# Altium schematic sheet [03]Pressure and Flow.SchDoc
size A3
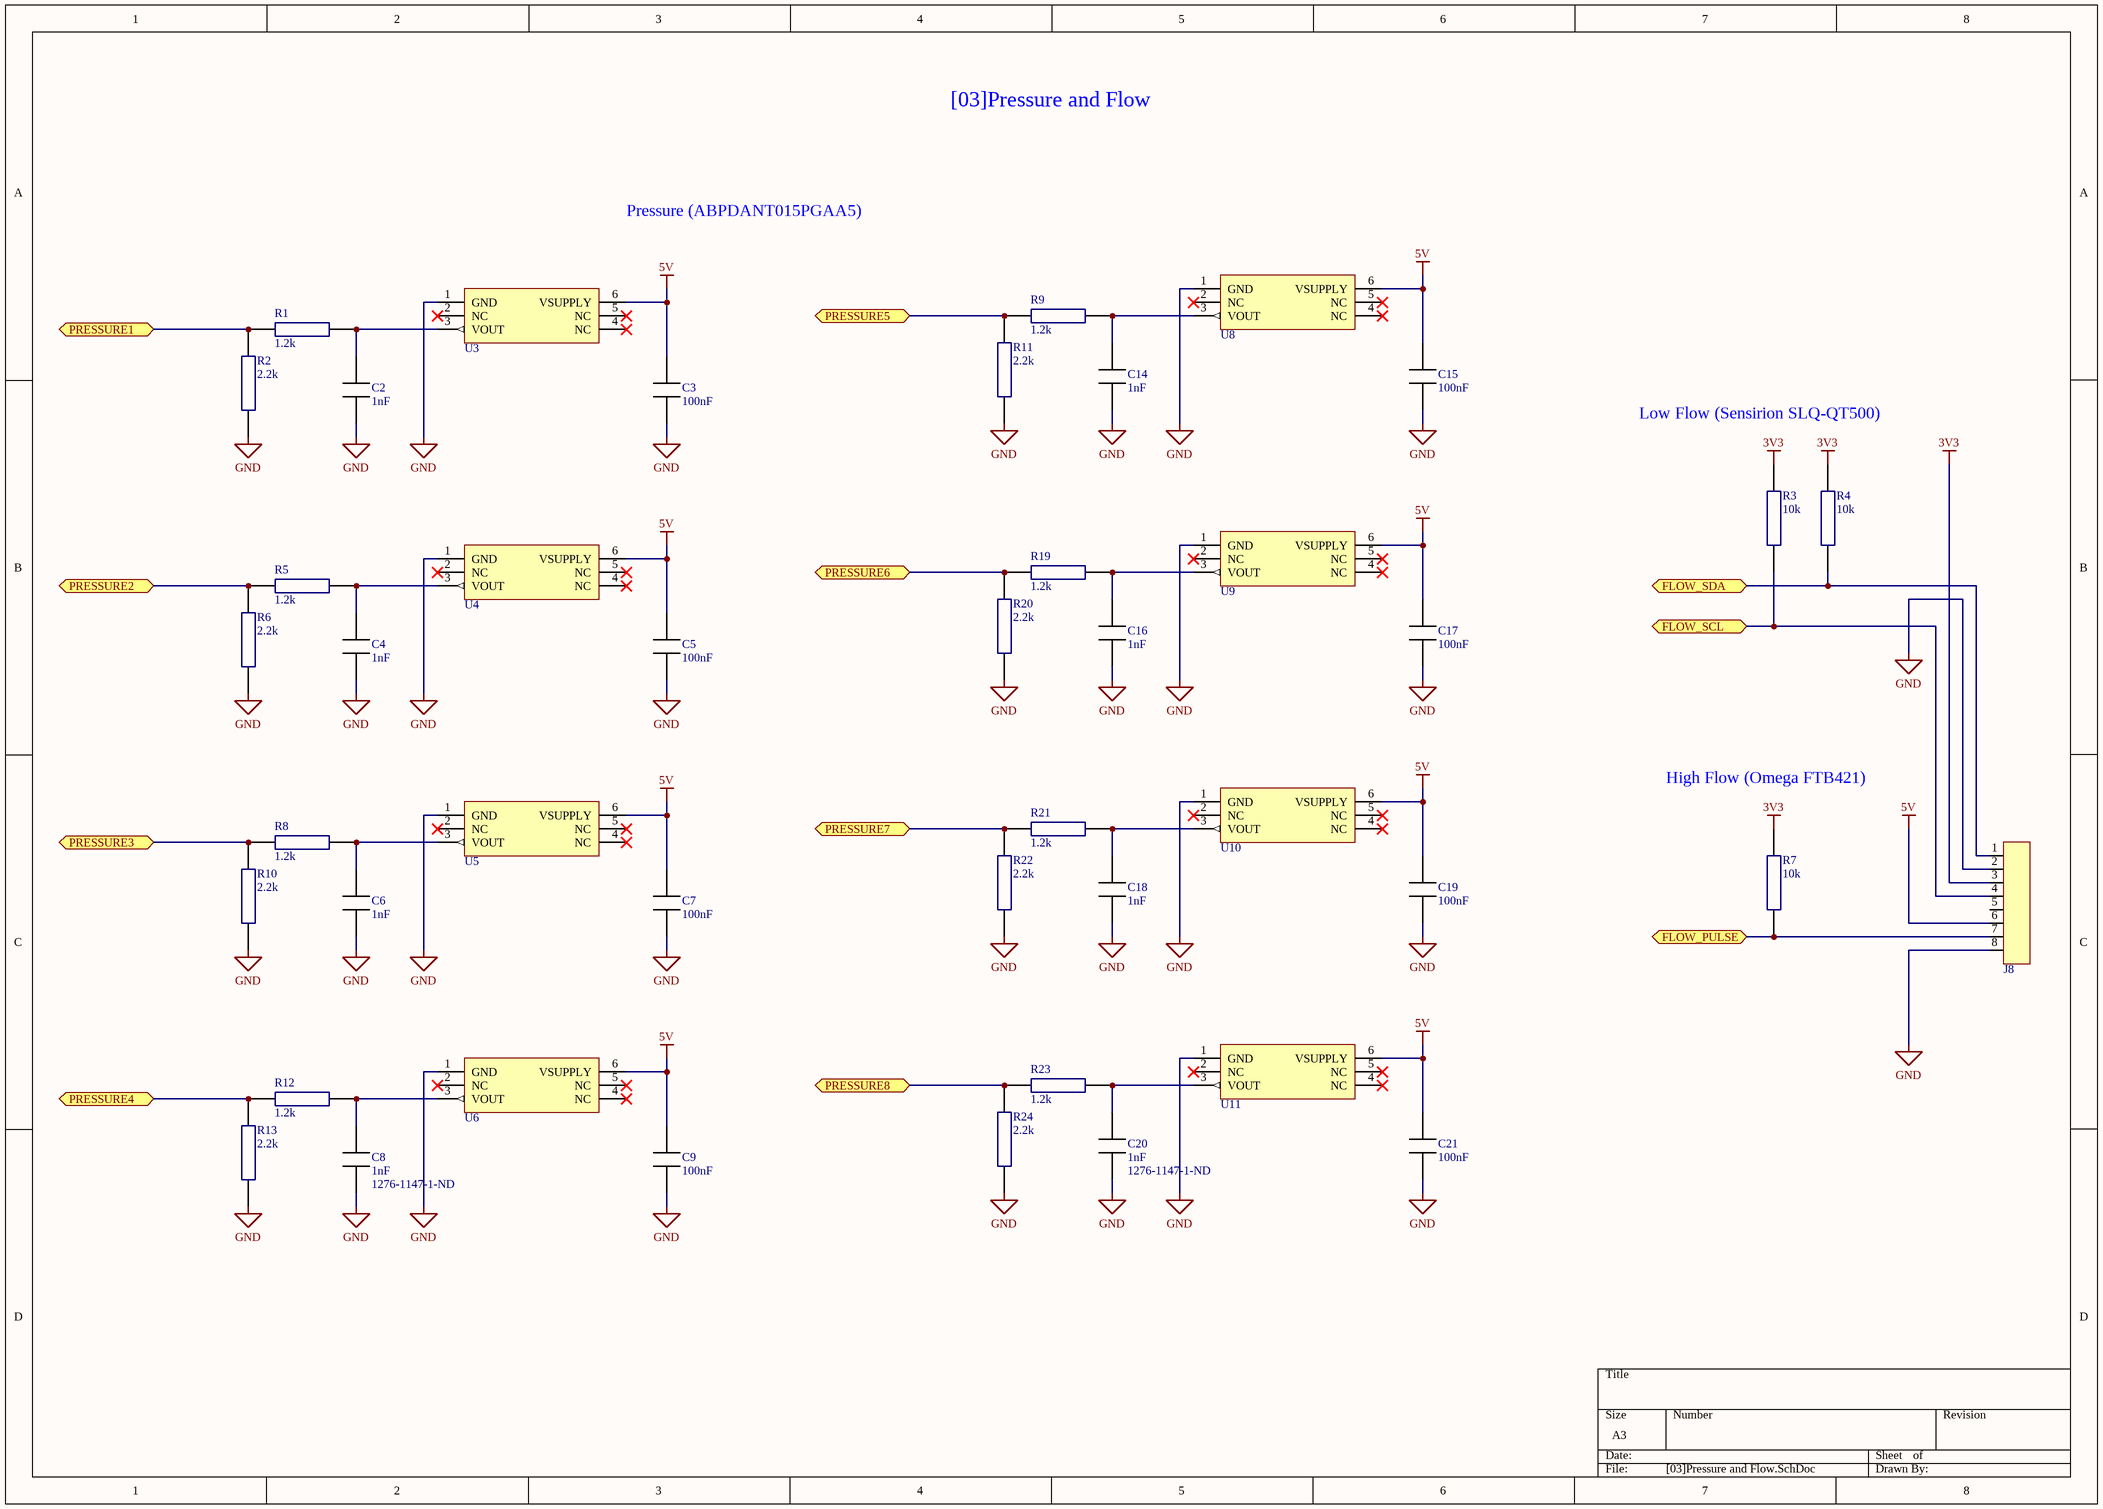
[diagram p0: [03]Pressure and Flow.SchDoc]

## Parts
C2  1nF  [CAPC2012X09N]
C3  100nF  [CAPC2012X09N]
C4  1nF  [CAPC2012X09N]
C5  100nF  [CAPC2012X09N]
C6  1nF  [CAPC2012X09N]
C7  100nF  [CAPC2012X09N]
C8  1nF  Supplier Part Number 1: 1276-1147-1-ND  [CAPC2012X09N]
C9  100nF  [CAPC2012X09N]
C14  1nF  [CAPC2012X09N]
C15  100nF  [CAPC2012X09N]
C16  1nF  [CAPC2012X09N]
C17  100nF  [CAPC2012X09N]
C18  1nF  [CAPC2012X09N]
C19  100nF  [CAPC2012X09N]
C20  1nF  Supplier Part Number 1: 1276-1147-1-ND  [CAPC2012X09N]
C21  100nF  [CAPC2012X09N]
J8  1771156  [1771156]  (value not drawn)
R1  1.2k  [RESC2012X07N_SAMSUNG]
R2  2.2k  [RESC2012X07N_SAMSUNG]
R3  10k  [RESC2012X07N_SAMSUNG]
R4  10k  [RESC2012X07N_SAMSUNG]
R5  1.2k  [RESC2012X07N_SAMSUNG]
R6  2.2k  [RESC2012X07N_SAMSUNG]
R7  10k  [RESC2012X07N_SAMSUNG]
R8  1.2k  [RESC2012X07N_SAMSUNG]
R9  1.2k  [RESC2012X07N_SAMSUNG]
R10  2.2k  [RESC2012X07N_SAMSUNG]
R11  2.2k  [RESC2012X07N_SAMSUNG]
R12  1.2k  [RESC2012X07N_SAMSUNG]
R13  2.2k  [RESC2012X07N_SAMSUNG]
R19  1.2k  [RESC2012X07N_SAMSUNG]
R20  2.2k  [RESC2012X07N_SAMSUNG]
R21  1.2k  [RESC2012X07N_SAMSUNG]
R22  2.2k  [RESC2012X07N_SAMSUNG]
R23  1.2k  [RESC2012X07N_SAMSUNG]
R24  2.2k  [RESC2012X07N_SAMSUNG]
U3  ABPDANT015PGAA5_SMD  [DIP6 SMD]  (value not drawn)
U4  ABPDANT015PGAA5_SMD  [DIP6 SMD]  (value not drawn)
U5  ABPDANT015PGAA5_SMD  [DIP6 SMD]  (value not drawn)
U6  ABPDANT015PGAA5_SMD  [DIP6 SMD]  (value not drawn)
U8  ABPDANT015PGAA5_SMD  [DIP6 SMD]  (value not drawn)
U9  ABPDANT015PGAA5_SMD  [DIP6 SMD]  (value not drawn)
U10  ABPDANT015PGAA5_SMD  [DIP6 SMD]  (value not drawn)
U11  ABPDANT015PGAA5_SMD  [DIP6 SMD]  (value not drawn)

## Ports
FLOW_PULSE (bidir), FLOW_SCL (bidir), FLOW_SDA (bidir), PRESSURE1 (bidir), PRESSURE2 (bidir), PRESSURE3 (bidir), PRESSURE4 (bidir), PRESSURE5 (bidir), PRESSURE6 (bidir), PRESSURE7 (bidir), PRESSURE8 (bidir)

## Nets
3V3: J8.3 R3.2 R4.2 R7.2
5V: C3.2 C5.2 C7.2 C9.2 C15.2 C17.2 C19.2 C21.2 J8.6 U3.6(VSUPPLY) U4.6(VSUPPLY) U5.6(VSUPPLY) U6.6(VSUPPLY) U8.6(VSUPPLY) U9.6(VSUPPLY) U10.6(VSUPPLY) U11.6(VSUPPLY)
GND: C2.1 C3.1 C4.1 C5.1 C6.1 C7.1 C8.1 C9.1 C14.1 C15.1 C16.1 C17.1 C18.1 C19.1 C20.1 C21.1 J8.2 J8.8 R2.1 R6.1 R10.1 R11.1 R13.1 R20.1 R22.1 R24.1 U3.1(GND) U4.1(GND) U5.1(GND) U6.1(GND) U8.1(GND) U9.1(GND) U10.1(GND) U11.1(GND)
FLOW_PULSE: J8.7 R7.1 ; port FLOW_PULSE
FLOW_SCL: J8.4 R3.1 ; port FLOW_SCL
FLOW_SDA: J8.1 R4.1 ; port FLOW_SDA
PRESSURE1: R1.1 R2.2 ; port PRESSURE1
PRESSURE2: R5.1 R6.2 ; port PRESSURE2
PRESSURE3: R8.1 R10.2 ; port PRESSURE3
PRESSURE4: R12.1 R13.2 ; port PRESSURE4
PRESSURE5: R9.1 R11.2 ; port PRESSURE5
PRESSURE6: R19.1 R20.2 ; port PRESSURE6
PRESSURE7: R21.1 R22.2 ; port PRESSURE7
PRESSURE8: R23.1 R24.2 ; port PRESSURE8
NetC2_2: C2.2 R1.2 U3.3(VOUT)
NetC4_2: C4.2 R5.2 U4.3(VOUT)
NetC6_2: C6.2 R8.2 U5.3(VOUT)
NetC8_2: C8.2 R12.2 U6.3(VOUT)
NetC14_2: C14.2 R9.2 U8.3(VOUT)
NetC16_2: C16.2 R19.2 U9.3(VOUT)
NetC18_2: C18.2 R21.2 U10.3(VOUT)
NetC20_2: C20.2 R23.2 U11.3(VOUT)

Not connected (* = marked no-connect by the designer): J8 5; U3 2(NC)* 4(NC)* 5(NC)*; U4 2(NC)* 4(NC)* 5(NC)*; U5 2(NC)* 4(NC)* 5(NC)*; U6 2(NC)* 4(NC)* 5(NC)*; U8 2(NC)* 4(NC)* 5(NC)*; U9 2(NC)* 4(NC)* 5(NC)*; U10 2(NC)* 4(NC)* 5(NC)*; U11 2(NC)* 4(NC)* 5(NC)*

## Notes on the sheet
- [03]Pressure and Flow
- Pressure (ABPDANT015PGAA5)
- Low Flow (Sensirion SLQ-QT500)
- High Flow (Omega FTB421)

## Library data of the parts
C2 C4 C6 C8 C14 C16 C18 C20 = CL21C102JBCNNNC: CAP CER 1nF 50V C0G/NP0 0805; Manufacturer: Samsung Electro-Mechanics America, Inc.; Manufacturer Part Number: CL21F104ZBCNNNC; Capacitance: 0.10µF; Tolerance: -20%, +80%; Temperature Coefficient: Y5V (F); RoHS: RoHS Compliant; Category: Capacitors; Packaging: Cut Tape (CT); Voltage - Rated: 50V; Mounting Type: Surface Mount, MLCC; Operating Temperature: -30°C ~ 85°C; Applications: General Purpose; Ratings: -; Package / Case: 0805 (2012 Metric); Size / Dimension: 0.079" L x 0.049" W (2.00mm x 1.25mm); Height - Seated (Max): -; Thickness (Max): 0.037" (0.95mm); Lead Spacing: -; Features: -; Lead Style: -; ComponentLink1URL: http://www.samsungsem.com/kr/support/product-search/mlcc/CL21F104ZBCNNNC.jsp; ComponentLink1Description: http://www.samsungsem.com/kr/support/product-search/mlcc/CL21F104ZBCNNNC.jsp; Supplier 1: Digi-Key
  C2 C4 C6 C14 C16 C18: Supplier Part Number 1: 1276-1147-1-ND
C3 C5 C7 C9 C15 C17 C19 C21 = CL21F104ZBCNNNC: CAP CER 0.1UF 50V Y5V 0805; Manufacturer: Samsung Electro-Mechanics America, Inc.; Capacitance: 0.10µF; Tolerance: -20%, +80%; Temperature Coefficient: Y5V (F); Supplier 1: Digi-Key; Manufacturer Part Number: CL21F104ZBCNNNC; RoHS: RoHS Compliant; Category: Capacitors; Stock 1: 1030146; Pricing 1: 1=0.1, 10=0.031, 25=0.022, 50=0.017, 100=0.0144, 500=0.01004, 1000=0.00783 (USD); Packaging: Cut Tape (CT); Voltage - Rated: 50V; Mounting Type: Surface Mount, MLCC; Operating Temperature: -30°C ~ 85°C; Applications: General Purpose; Ratings: -; Package / Case: 0805 (2012 Metric); Size / Dimension: 0.079" L x 0.049" W (2.00mm x 1.25mm); Height - Seated (Max): -; Thickness (Max): 0.037" (0.95mm); Lead Spacing: -; Features: -; Lead Style: -; ComponentLink1URL: http://www.samsungsem.com/kr/support/product-search/mlcc/CL21F104ZBCNNNC.jsp; ComponentLink1Description: http://www.samsungsem.com/kr/support/product-search/mlcc/CL21F104ZBCNNNC.jsp; Supplier Part Number 1: 1276-1007-1-ND
J8 = 1771156: CONN TERM BLK 8POS 2.5MM SMD; Manufacturer: Phoenix Contact; Positions Per Level: 8; Pitch: 0.098" (2.50mm); Mating Orientation: Vertical with Board; Wire Gauge: 20-26 AWG; Wire Termination: Screwless - Spring Cage, Tension Clamp; Supplier 1: Digi-Key; Manufacturer Part Number: 1771156; RoHS: RoHS Compliant; Category: Connectors, Interconnects; Stock 1: 2856; Pricing 1: 1=1.39, 10=1.334, 50=1.276, 100=1.2412 (USD); Packaging: Cut Tape (CT); Part Status: Active; Mounting Type: Surface Mount; Features: Solder Retention; Color: Black; Operating Temperature: -; Housing Material: Liquid Crystal Polymer (LCP); Contact Material - Plating: -; Clamp Material - Plating: -; Screw Material - Plating: -; Torque - Screw: -; Screw Thread: -; ComponentLink1URL: https://media.digikey.com/pdf/Data%20Sheets/Phoenix%20Contact%20PDFs/1771156.pdf; ComponentLink1Description: https://media.digikey.com/pdf/Data%20Sheets/Phoenix%20Contact%20PDFs/1771156.pdf; Supplier Part Number 1: 277-2078-1-ND
R1 R5 R8 R9 R12 R19 R21 R23 = RC2012F122CS: RES SMD 1.2K OHM 1% 1/8W 0805; Manufacturer: Samsung Electro-Mechanics America, Inc.; Manufacturer Part Number: RC2012F103CS; Resistance (Ohms): 10k; Power (Watts): 0.125W, 1/8W; Temperature Coefficient: ±100ppm/°C; RoHS: RoHS Compliant; Category: Resistors; Packaging: Cut Tape (CT); Tolerance: ±1%; Composition: Thick Film; Features: Moisture Resistant; Operating Temperature: -55°C ~ 155°C; Package / Case: 0805 (2012 Metric); Supplier Device Package: 0805 (2012 Metric); Size / Dimension: 0.079" L x 0.049" W (2.00mm x 1.25mm); Height: 0.024" (0.60mm); Number of Terminations: 2; ComponentLink1URL: http://media.digikey.com/pdf/Data%20Sheets/Samsung%20PDFs/RC_Series_ds.pdf; ComponentLink1Description: http://media.digikey.com/pdf/Data%20Sheets/Samsung%20PDFs/RC_Series_ds.pdf; Supplier 1: Digi-Key; Supplier Part Number 1: 1276-5275-1-ND
R2 R6 R10 R11 R13 R20 R22 R24 = RC2012F222CS: RES SMD 2.2K OHM 1% 1/8W 0805; Manufacturer: Samsung Electro-Mechanics America, Inc.; Manufacturer Part Number: RC2012F103CS; Resistance (Ohms): 10k; Power (Watts): 0.125W, 1/8W; Temperature Coefficient: ±100ppm/°C; RoHS: RoHS Compliant; Category: Resistors; Packaging: Cut Tape (CT); Tolerance: ±1%; Composition: Thick Film; Features: Moisture Resistant; Operating Temperature: -55°C ~ 155°C; Package / Case: 0805 (2012 Metric); Supplier Device Package: 0805 (2012 Metric); Size / Dimension: 0.079" L x 0.049" W (2.00mm x 1.25mm); Height: 0.024" (0.60mm); Number of Terminations: 2; ComponentLink1URL: http://media.digikey.com/pdf/Data%20Sheets/Samsung%20PDFs/RC_Series_ds.pdf; ComponentLink1Description: http://media.digikey.com/pdf/Data%20Sheets/Samsung%20PDFs/RC_Series_ds.pdf; Supplier 1: Digi-Key; Supplier Part Number 1: 1276-5290-1-ND
R3 R4 R7 = RC2012F103CS: RES SMD 10K OHM 1% 1/8W 0805; Manufacturer: Samsung Electro-Mechanics America, Inc.; Power (Watts): 0.125W, 1/8W; Temperature Coefficient: ±100ppm/°C; Manufacturer Part Number: RC2012F103CS; RoHS: RoHS Compliant; Category: Resistors; Packaging: Cut Tape (CT); Resistance (Ohms): 10k; Tolerance: ±1%; Composition: Thick Film; Features: Moisture Resistant; Operating Temperature: -55°C ~ 155°C; Package / Case: 0805 (2012 Metric); Supplier Device Package: 0805 (2012 Metric); Size / Dimension: 0.079" L x 0.049" W (2.00mm x 1.25mm); Height: 0.024" (0.60mm); Number of Terminations: 2; ComponentLink1URL: http://media.digikey.com/pdf/Data%20Sheets/Samsung%20PDFs/RC_Series_ds.pdf; ComponentLink1Description: http://media.digikey.com/pdf/Data%20Sheets/Samsung%20PDFs/RC_Series_ds.pdf; Supplier 1: Digi-Key; Supplier Part Number 1: 1276-5332-1-ND
U3-U6 U8-U11 = ABPDANT015PGAA5_SMD: Pressure Sensor 15 PSIG; Supplier 1: Digi-Key; Supplier Part Number 1: 480-6253-ND; Supplier 2: Digi-Key; Supplier Part Number 2: SAM1148-03-ND